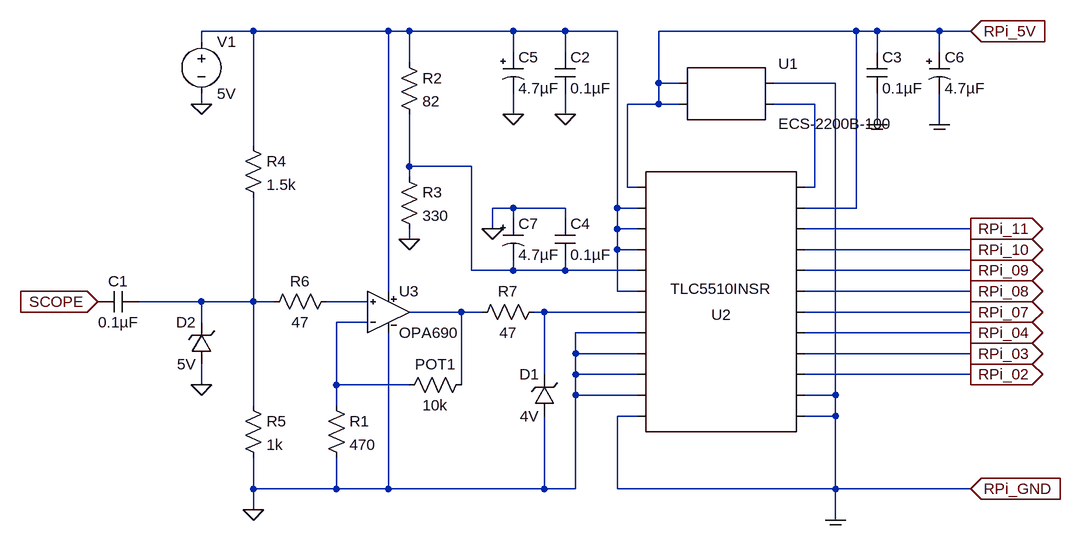
[diagram p0: schematic ADC.asc]
ADC.asc, the LTspice schematic file:
Version 4
SHEET 1 1748 680
WIRE 480 -288 400 -288
WIRE 688 -288 480 -288
WIRE 720 -288 688 -288
WIRE 880 -288 720 -288
WIRE 960 -288 880 -288
WIRE 1040 -288 960 -288
WIRE 1408 -288 1104 -288
WIRE 1440 -288 1408 -288
WIRE 1536 -288 1440 -288
WIRE 1584 -288 1536 -288
WIRE 400 -272 400 -288
WIRE 880 -256 880 -288
WIRE 960 -256 960 -288
WIRE 1440 -256 1440 -288
WIRE 1536 -256 1536 -288
WIRE 720 -240 720 -288
WIRE 1104 -208 1104 -288
WIRE 1136 -208 1104 -208
WIRE 1376 -208 1280 -208
WIRE 400 -176 400 -192
WIRE 1104 -176 1104 -208
WIRE 1104 -176 1056 -176
WIRE 1136 -176 1104 -176
WIRE 1344 -176 1280 -176
WIRE 880 -160 880 -192
WIRE 960 -160 960 -192
WIRE 1440 -144 1440 -192
WIRE 1536 -144 1536 -192
WIRE 480 -112 480 -288
WIRE 720 -80 720 -160
WIRE 816 -80 720 -80
WIRE 720 -64 720 -80
WIRE 1056 -48 1056 -176
WIRE 1072 -48 1056 -48
WIRE 1344 -48 1344 -176
WIRE 1344 -48 1328 -48
WIRE 880 -16 848 -16
WIRE 960 -16 880 -16
WIRE 1040 -16 1040 -288
WIRE 1072 -16 1040 -16
WIRE 1408 -16 1408 -288
WIRE 1408 -16 1328 -16
WIRE 880 0 880 -16
WIRE 960 0 960 -16
WIRE 848 16 848 -16
WIRE 1040 16 1040 -16
WIRE 1072 16 1040 16
WIRE 1584 16 1328 16
WIRE 720 32 720 16
WIRE 1040 48 1040 16
WIRE 1072 48 1040 48
WIRE 1584 48 1328 48
WIRE 816 80 816 -80
WIRE 880 80 880 64
WIRE 880 80 816 80
WIRE 960 80 960 64
WIRE 960 80 880 80
WIRE 1072 80 960 80
WIRE 1584 80 1328 80
WIRE 688 112 688 -288
WIRE 1040 112 1040 48
WIRE 1072 112 1040 112
WIRE 1584 112 1328 112
WIRE 400 128 304 128
WIRE 480 128 480 -32
WIRE 480 128 400 128
WIRE 512 128 480 128
WIRE 656 128 592 128
WIRE 800 144 720 144
WIRE 832 144 800 144
WIRE 928 144 912 144
WIRE 1072 144 928 144
WIRE 1584 144 1328 144
WIRE 400 160 400 128
WIRE 656 160 608 160
WIRE 1072 176 976 176
WIRE 1584 176 1328 176
WIRE 976 208 976 176
WIRE 1072 208 976 208
WIRE 1584 208 1328 208
WIRE 928 240 928 144
WIRE 976 240 976 208
WIRE 1072 240 976 240
WIRE 1584 240 1328 240
WIRE 400 256 400 224
WIRE 608 256 608 160
WIRE 720 256 608 256
WIRE 800 256 800 144
WIRE 976 272 976 240
WIRE 1072 272 976 272
WIRE 1376 272 1376 -208
WIRE 1376 272 1328 272
WIRE 480 288 480 128
WIRE 608 288 608 256
WIRE 1072 304 1040 304
WIRE 1376 304 1376 272
WIRE 1376 304 1328 304
WIRE 480 416 480 368
WIRE 608 416 608 368
WIRE 608 416 480 416
WIRE 688 416 688 176
WIRE 688 416 608 416
WIRE 928 416 928 304
WIRE 928 416 688 416
WIRE 976 416 976 272
WIRE 976 416 928 416
WIRE 1040 416 1040 304
WIRE 1376 416 1376 304
WIRE 1376 416 1040 416
WIRE 1584 416 1376 416
WIRE 480 448 480 416
WIRE 1376 464 1376 416
FLAG 400 -176 0
FLAG 1584 240 RPi_02
IOPIN 1584 240 Out
FLAG 1584 208 RPi_03
IOPIN 1584 208 Out
FLAG 1584 176 RPi_04
IOPIN 1584 176 Out
FLAG 1584 144 RPi_07
IOPIN 1584 144 Out
FLAG 1584 112 RPi_08
IOPIN 1584 112 Out
FLAG 1584 80 RPi_09
IOPIN 1584 80 Out
FLAG 1584 48 RPi_10
IOPIN 1584 48 Out
FLAG 1584 16 RPi_11
IOPIN 1584 16 Out
FLAG 1584 416 RPi_GND
IOPIN 1584 416 In
FLAG 1584 -288 RPi_5V
IOPIN 1584 -288 In
FLAG 848 16 0
FLAG 1376 464 COM
FLAG 720 32 0
FLAG 880 -160 0
FLAG 960 -160 0
FLAG 1440 -144 COM
FLAG 1536 -144 COM
FLAG 480 448 0
FLAG 240 128 SCOPE
IOPIN 240 128 In
FLAG 400 256 0
SYMBOL AutoGenerated\\ECS-2200B-100 1200 -192 R0
SYMATTR InstName U1
SYMBOL AutoGenerated\\TLC5510INSR 1200 128 R180
SYMATTR InstName U2
SYMBOL voltage 400 -288 R0
WINDOW 123 0 0 Left 0
WINDOW 39 0 0 Left 0
SYMATTR InstName V1
SYMATTR Value 5V
SYMBOL cap 944 -256 R0
SYMATTR InstName C2
SYMATTR Value 0.1µF
SYMBOL polcap 864 -256 R0
WINDOW 3 24 56 Left 2
SYMATTR Value 4.7µF
SYMATTR InstName C5
SYMATTR Description Capacitor
SYMATTR Type cap
SYMBOL polcap 864 0 R0
WINDOW 3 24 56 Left 2
SYMATTR Value 4.7µF
SYMATTR InstName C7
SYMATTR Description Capacitor
SYMATTR Type cap
SYMBOL cap 1424 -256 R0
SYMATTR InstName C3
SYMATTR Value 0.1µF
SYMBOL polcap 1520 -256 R0
WINDOW 3 24 56 Left 2
SYMATTR Value 4.7µF
SYMATTR InstName C6
SYMATTR Description Capacitor
SYMATTR Type cap
SYMBOL res 704 -256 R0
SYMATTR InstName R2
SYMATTR Value 82
SYMBOL res 704 -80 R0
SYMATTR InstName R3
SYMATTR Value 330
SYMBOL res 928 128 R90
WINDOW 0 0 56 VBottom 2
WINDOW 3 32 56 VTop 2
SYMATTR InstName R7
SYMATTR Value 47
SYMBOL opamp3 688 80 R0
SYMATTR InstName U3
SYMATTR Value OPA690
SYMBOL res 816 240 R90
WINDOW 0 0 56 VBottom 2
WINDOW 3 32 56 VTop 2
SYMATTR InstName POT1
SYMATTR Value 10k
SYMBOL res 592 272 R0
SYMATTR InstName R1
SYMATTR Value 470
SYMBOL res 608 112 R90
WINDOW 0 0 56 VBottom 2
WINDOW 3 32 56 VTop 2
SYMATTR InstName R6
SYMATTR Value 47
SYMBOL res 464 -128 R0
SYMATTR InstName R4
SYMATTR Value 1.5k
SYMBOL res 464 272 R0
SYMATTR InstName R5
SYMATTR Value 1k
SYMBOL zener 944 304 R180
WINDOW 0 24 64 Left 2
WINDOW 3 24 0 Left 2
SYMATTR InstName D1
SYMATTR Value 4V
SYMBOL zener 416 224 R180
WINDOW 0 24 64 Left 2
WINDOW 3 24 0 Left 2
SYMATTR InstName D2
SYMATTR Value 5V
SYMBOL cap 304 112 R90
WINDOW 0 0 32 VBottom 2
WINDOW 3 32 32 VTop 2
SYMATTR InstName C1
SYMATTR Value 0.1µF
SYMBOL cap 944 0 R0
SYMATTR InstName C4
SYMATTR Value 0.1µF

The netlist it stands for:
* ADC.asc
* U1: ECS-2200B-100 (symbol AutoGenerated\ECS-2200B-100 not available, pins judged from their places): pin1=RPi_5V pin2=RPi_5V pin3=COM pin4=N002
* U2: TLC5510INSR (symbol AutoGenerated\TLC5510INSR not available, pins judged from their places): pin1=COM pin2=COM pin3=RPi_02 pin4=RPi_03 pin5=RPi_04 pin6=RPi_07 pin7=RPi_08 pin8=RPi_09 pin9=RPi_10 pin10=RPi_11 pin11=RPi_5V pin12=N002 pin13=COM pin14=0 pin15=0 pin16=0 pin17=0 pin18=N007 pin19=N001 pin20=N003 pin21=N001 pin22=N001 pin23=N001 pin24=RPi_5V
V1 N001 0 5V
C2 N001 0 0.1µF
C5 N001 0 4.7µF
C7 0 N003 4.7µF
C3 RPi_5V COM 0.1µF
C6 RPi_5V COM 4.7µF
R2 N001 N003 82
R3 N003 0 330
R7 N007 N006 47
XU3 N005 N008 N001 0 N006 OPA690  ; pins In+ In- V+ V- OUT
R§POT1 N006 N008 10k
R1 N008 0 470
R6 N005 N004 47
R4 N001 N004 1.5k
R5 N004 0 1k
D1 0 N007 4V
D2 0 N004 5V
C1 N004 SCOPE 0.1µF
C4 0 N003 0.1µF
.model D D
.lib standard.dio
.backanno
.end